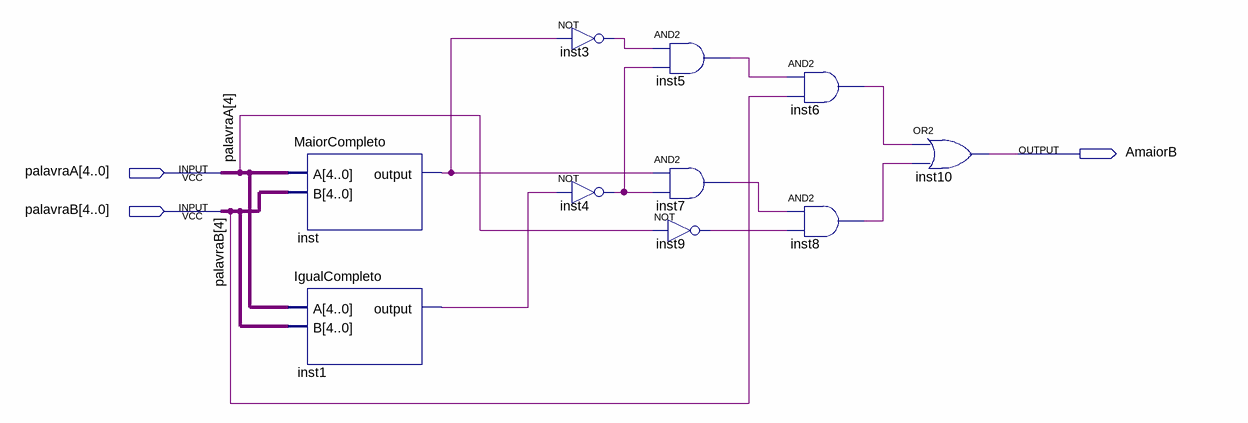
[diagram p0: schematic sheet]
// Quartus schematic AmaiorB.bdf as structural Verilog: 10 symbols, 3 pins
module AmaiorB (
  input  [4:0] palavraA,
  input  [4:0] palavraB,
  output AmaiorB
);

  wire inst1_output, inst3_out, inst4_out, inst5_out, inst6_out, inst7_out, inst8_out, inst9_out, inst_output;

  MaiorCompleto inst (.A(palavraA), .B(palavraB), .\output (inst_output));
  IgualCompleto inst1 (.A(palavraA), .B(palavraB), .\output (inst1_output));
  not inst3 (inst3_out, inst_output);
  not inst4 (inst4_out, inst1_output);
  and inst5 (inst5_out, inst3_out, inst4_out);
  and inst7 (inst7_out, inst_output, inst4_out);
  not inst9 (inst9_out, palavraA[4]);
  and inst6 (inst6_out, inst5_out, palavraB[4]);
  and inst8 (inst8_out, inst7_out, inst9_out);
  or inst10 (AmaiorB, inst6_out, inst8_out);
endmodule
